# EAGLE design board 3 (EAGLE 9.6.2)
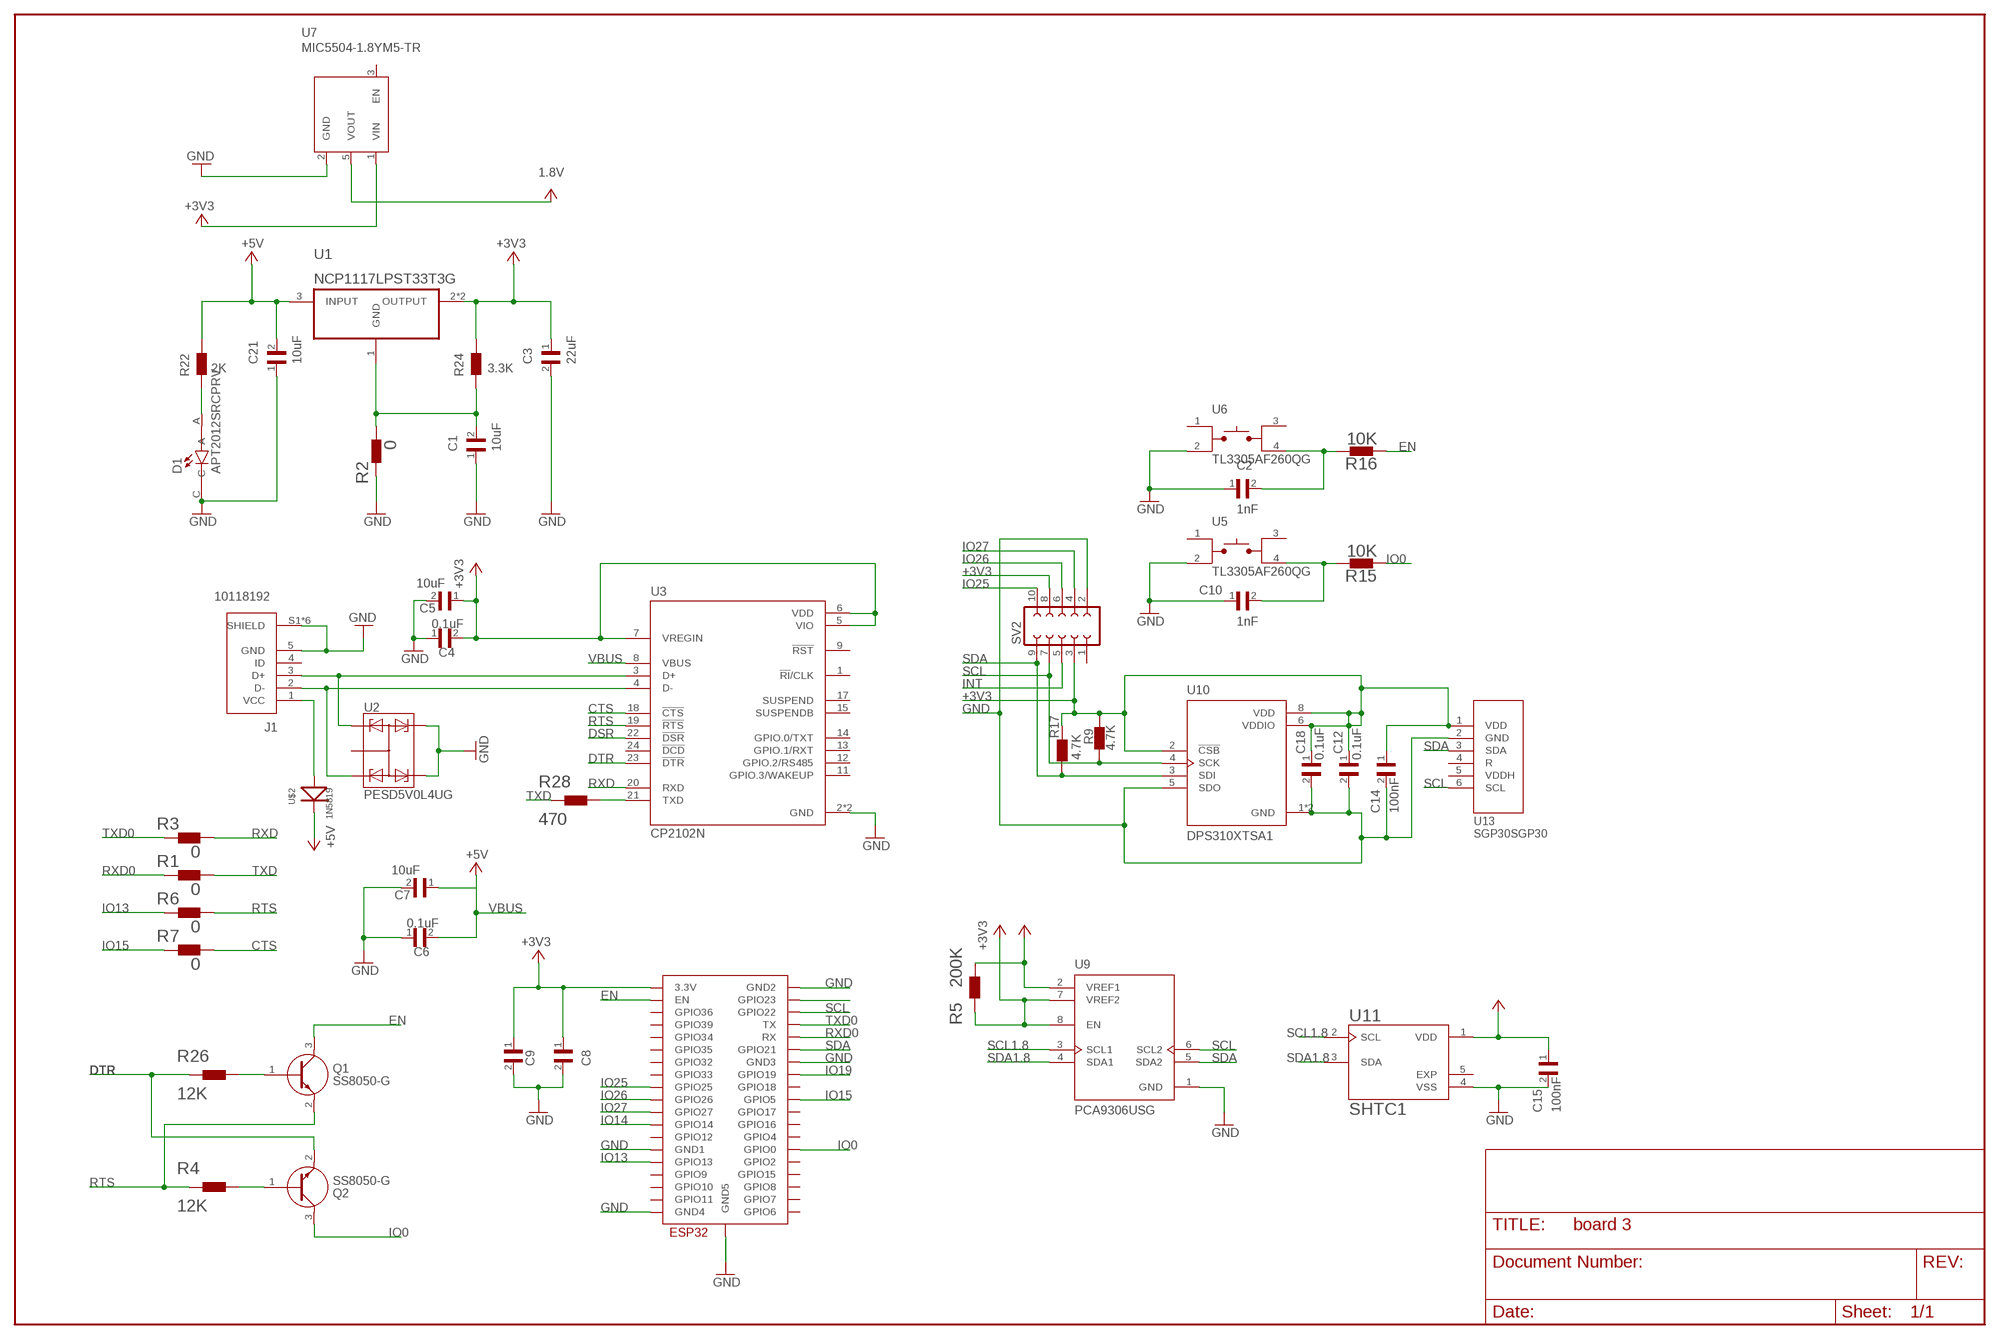
[diagram p0: schematic, sheet 1]

## Parts
C1  10uF  CL21A106KAYNNNE  [CAPC2012X135N]
C2  1nF  CL10B102KB8NNNC  [CAPC1608X90N]
C3  22uF  CL10A226MQ8NRNC  [CAPC1608X90N]
C4  0.1uF  CL05A104KA5NNNC  [CAPC1005X55N]
C5  10uF  CL21A106KAYNNNE  [CAPC2012X135N]
C6  0.1uF  CL05A104KA5NNNC  [CAPC1005X55N]
C7  10uF  CL21A106KAYNNNE  [CAPC2012X135N]
C8  CL10A475KQ8NNNC  [CAPC1608X90N]
C9  100uF 6.3V 20%  CL10A475KQ8NNNC  [CAPC1608X90N]
C10  1nF  CL10B102KB8NNNC  [CAPC1608X90N]
C12  0.1uF  CL05A104KA5NNNC  [CAPC1005X55N]
C14  100nF  CL10A226MQ8NRNC  [CAPC1608X90N]
C15  100nF  CL10A226MQ8NRNC  [CAPC1608X90N]
C18  0.1uF  CL05A104KA5NNNC  [CAPC1005X55N]
C21  10uF  CL21A106KAYNNNE  [CAPC2012X135N]
D1  APT2012SRCPRV  [LEDC2012X75N]
J1  10118192  10118192-0002LF  [AMPHENOL_10118192-0002LF]
Q1  SS8050-G  [SOT95P240X115-3N]
Q2  SS8050-G  [SOT95P240X115-3N]
R1  0  ERJ-1GE0R00C  [RESC0603X26N]
R2  0  ERJ-1GE0R00C  [RESC0603X26N]
R3  0  ERJ-1GE0R00C  [RESC0603X26N]
R4  12K  ERJ-P6WF1202V  [RESC2012X75N]
R5  200K  ERJ-P6WF2202V  [RESC2012X75N]
R6  0  ERJ-1GE0R00C  [RESC0603X26N]
R7  0  ERJ-1GE0R00C  [RESC0603X26N]
R9  4.7K  ERA-3AEB472V  [RESC1608X55N]
R15  10K  ERJ-P06F1002V  [RESC2012X70N]
R16  10K  ERJ-P06F1002V  [RESC2012X70N]
R17  4.7K  ERA-3AEB472V  [RESC1608X55N]
R22  2K  ERJ-P06D2001V  [RESC2012X70N]
R24  3.3K  ERJ-P06F3301V  [RESC2012X70N]
R26  12K  ERJ-P6WF1202V  [RESC2012X75N]
R28  470  ERJ-P14J471U  [RESC3225X70N]
SV2  FE05-2  [FE05-2]
U1  NCP1117LPST33T3G  [SOT230P700X175-4N]
U2  PESD5V0L4UG  PESD5V0L4UG,115  [SOT65P210X110-5N]
U3  CP2102N  CP2102N-A02-GQFN24R  [QFN50P400X400X80-25N]
U5  TL3305AF260QG  [SW_TL3305AF260QG]
U6  TL3305AF260QG  [SW_TL3305AF260QG]
U7  MIC5504-1.8YM5-TR  [SOT23-5P95_280X145XL45X37N]
U9  PCA9306USG  [SOP50P310X90-8N]
U10  DPS310XTSA1  [XDCR_DPS310XTSA1]
U11  SHTC1  [XDCR_SHTC1]
U13  SGP30SGP30  [SGP30]
U$1  ESP32-WROOM  [ESP32-WROOM]
U$2  1N5819  [SOD-123]

## Nets
1.8V: U7.5(VOUT) ; supply symbol labelled VCC
+3V3: C3.1 C4.2 C5.1 C8.1 C9.1 C12.1 C14.1 C18.1 R5.1 R9.2 R17.2 R24.2 SV2.3 SV2.8 U1.2(OUTPUT) U1.4(OUTPUT) U3.5(VIO) U3.6(VDD) U3.7(VREGIN) U7.1(VIN) U9.7(VREF2) U9.8(EN) U10.2(!CSB) U10.6(VDDIO) U10.8(VDD) U13.1(VDD) U$1.3V3(3.3V)
+5V: C21.2 R22.2 U1.3(INPUT) U$2.K
CTS: R7.2 U3.18(!CTS)
DSR: U3.22(!DSR)
DTR: Q2.2(E) R26.1 U3.23(!DTR)
EN: Q1.3(C) R16.1 U$1.EN
GND: C1.1 C2.1 C3.2 C4.1 C5.2 C6.1 C7.2 C8.2 C9.2 C10.1 C12.2 C14.2 C15.2 C18.2 C21.1 D1.C J1.5(GND) J1.S1(SHIELD) J1.S2(SHIELD) J1.S3(SHIELD) J1.S4(SHIELD) J1.S5(SHIELD) J1.S6(SHIELD) R2.1 SV2.2 U2.4 U2.5 U3.2(GND) U3.25(GND) U5.2 U6.2 U7.2(GND) U9.1(GND) U10.1(GND) U10.5(SDO) U10.7(GND) U11.4(VSS) U13.2(GND) U$1.GND1 U$1.GND2 U$1.GND3 U$1.GND4 U$1.GND5
INT: SV2.5
IO0: Q2.3(C) R15.1 U$1.IO0(GPIO0)
IO13: R6.1 U$1.IO13(GPIO13)
IO14: U$1.IO14(GPIO14)
IO15: R7.1 U$1.IO5(GPIO5)
IO19: U$1.IO19(GPIO19)
IO25: SV2.10 U$1.IO25(GPIO25)
IO26: SV2.6 U$1.IO26(GPIO26)
IO27: SV2.4 U$1.IO27(GPIO27)
N$1: J1.2(D-) U2.3 U3.4(D-)
N$2: J1.3(D+) U2.1 U3.3(D+)
N$3: J1.1(VCC) U$2.A
N$4: R28.2 U3.21(TXD)
N$5: D1.A R22.1
N$6: C1.2 R2.2 R24.1 U1.1(GND)
N$8: U$1.IO23(GPIO23)
N$9: Q1.1(B) R26.2
N$11: Q2.1(B) R4.2
N$14: C2.2 R16.2 U6.4
N$19: C10.2 R15.2 U5.4
RTS: Q1.2(E) R4.1 R6.2 U3.19(!RTS)
RXD: R3.2 U3.20(RXD)
RXD0: R1.1 U$1.RX
SCL: R9.1 SV2.7 U9.6(SCL2) U10.4(SCK) U13.6(SCL) U$1.IO22(GPIO22)
SCL1.8: U9.3(SCL1) U11.2(SCL)
SDA: R17.1 SV2.9 U9.5(SDA2) U10.3(SDI) U13.3(SDA) U$1.IO21(GPIO21)
SDA1.8: U9.4(SDA1) U11.3(SDA)
TXD: R1.2 R28.1
TXD0: R3.1 U$1.TX
VBUS: C6.2 C7.1 U3.8(VBUS) ; supply symbol labelled +5V
VCC: C15.1 R5.2 U9.2(VREF1) U11.1(VDD) ; supply symbol labelled 1.8V
Unconnected: J1.4(ID) SV2.1 U2.2 U3.1(!RI!/CLK) U3.9(!RST) U3.11(GPIO.3/WAKEUP) U3.12(GPIO.2/RS485) U3.13(GPIO.1/RXT) U3.14(GPIO.0/TXT) U3.15(SUSPENDB) U3.17(SUSPEND) U3.24(!DCD) U5.1 U5.3 U6.1 U6.3 U7.3(EN) U11.5(EXP) U13.4(R) U13.5(VDDH) U$1.CLK(GPIO6) U$1.CMD(GPIO11) U$1.IO2(GPIO2) U$1.IO4(GPIO4) U$1.IO12(GPIO12) U$1.IO15(GPIO15) U$1.IO16(GPIO16) U$1.IO17(GPIO17) U$1.IO18(GPIO18) U$1.IO32(GPIO32) U$1.IO33(GPIO33) U$1.IO34(GPIO34) U$1.IO35(GPIO35) U$1.SD0(GPIO7) U$1.SD1(GPIO8) U$1.SD2(GPIO9) U$1.SD3(GPIO10) U$1.SENSOR_VN(GPIO39) U$1.SENSOR_VP(GPIO36)

## Library data of the parts
C1 C5 C7 C21 = CL21A106KAYNNNE:CL21A106KAYNNNE: Cap Ceramic 10uF 25V X5R 10% SMD 0805 85°C Embossed T/R; DESCRIPTION: 10µF ±10% 25V Ceramic Capacitor X5R 0805 (2012 Metric); DIGI-KEY_PART_NUMBER: 1276-2891-1-ND; MF: Samsung Electro-Mechanics; MP: CL21A106KAYNNNE; PACKAGE: 0805 Samsung; PURCHASE-URL: https://pricing.snapeda.com/search/part/CL21A106KAYNNNE/?ref=eda
C2 C10 = CL10B102KB8NNNC:CL10B102KB8NNNC: Capacitor: ceramic; MLCC; 1nF; 50V; X7R; ±10%; SMD; 0603; -55÷125°C; DESCRIPTION: 1000pF ±10% 50V Ceramic Capacitor X7R 0603 (1608 Metric); DIGI-KEY_PART_NUMBER: 1276-1018-1-ND; MF: Samsung; MP: CL10B102KB8NNNC; PACKAGE: 0603 Samsung; PURCHASE-URL: https://pricing.snapeda.com/search/part/CL10B102KB8NNNC/?ref=eda
C3 C14 C15 = CL10A226MQ8NRNC:CL10A226MQ8NRNC: Cap Ceramic 22uF 6.3V X5R 20% SMD 0603 85°C Cardboard T/R; DESCRIPTION: 22µF ±20% 6.3V Ceramic Capacitor X5R 0603 (1608 Metric); DIGI-KEY_PART_NUMBER: 1276-1193-1-ND; MF: Samsung Electro-Mechanics; MP: CL10A226MQ8NRNC; PACKAGE: 0603 Samsung; PURCHASE-URL: https://pricing.snapeda.com/search/part/CL10A226MQ8NRNC/?ref=eda
C4 C6 C12 C18 = CL05A104KA5NNNC:CL05A104KA5NNNC: Capacitor [Samsung] CL05A104KA5NNNC Capacitor; DESCRIPTION: 0.1µF ±10% 25V Ceramic Capacitor X5R 0402 (1005 Metric); DIGI-KEY_PART_NUMBER: 1276-1043-1-ND; MF: Samsung Electro-Mechanics; MP: CL05A104KA5NNNC; PACKAGE: 0402 Samsung; PURCHASE-URL: https://pricing.snapeda.com/search/part/CL05A104KA5NNNC/?ref=eda
C8 C9 = CL10A475KQ8NNNC:CL10A475KQ8NNNC: Cap Ceramic 4.7uF 6.3V X5R 10% Pad SMD 0603 85C T/R; DESCRIPTION: 4.7µF ±10% 6.3V Ceramic Capacitor X5R 0603 (1608 Metric); DIGI-KEY_PART_NUMBER: 1276-1045-1-ND; MF: Samsung Electro-Mechanics; MP: CL10A475KQ8NNNC; PACKAGE: 0603 Samsung; PURCHASE-URL: https://pricing.snapeda.com/search/part/CL10A475KQ8NNNC/?ref=eda
D1 = APT2012SRCPRV:APT2012SRCPRV: 2.0X1.2MM,RED SMD LED; DESCRIPTION: Red 640nm LED Indication - Discrete 1.85V 0805 (2012 Metric); DIGI-KEY_PART_NUMBER: 754-1132-1-ND; MF: Kingbright; MP: APT2012SRCPRV; PACKAGE: 0805 Kingbright; PURCHASE-URL: https://pricing.snapeda.com/search/part/APT2012SRCPRV/?ref=eda
J1 = micro usb 10118192-0002LF:10118192-0002LF: USB - micro B USB 2.0 Receptacle Connector 5 Position Surface Mount, Right Angle; DESCRIPTION: USB - micro B USB 2.0 Receptacle Connector 5 Position Surface Mount, Right Angle; DIGI-KEY_PART_NUMBER: 609-5379-1-ND; MF: Amphenol ICC (FCI); MP: 10118192-0002LF; PACKAGE: None; PURCHASE-URL: https://pricing.snapeda.com/search/part/10118192-0002LF/?ref=eda
Q1 Q2 = SS8050-G:SS8050-G: Bipolar Transistors - BJT NPN TRANSISTOR 1.5A 40V Source: Datasheet <http://www.comchiptech.com/admin/files/product/SS8050-G RevA181526.pdf> Check prices <https://pricing.snapeda.com/parts/SS8050-G/Comchip%20Technology/view-part?ref=eda>; AVAILABILITY: Good; DESCRIPTION: Bipolar (BJT) Transistor NPN 25V 1.5A 100MHz 300mW Surface Mount SOT-23; MF: Comchip Technology; MP: SS8050-G; PACKAGE: TO-236 Comchip; PRICE: None; PURCHASE-URL: https://pricing.snapeda.com/search/part/SS8050-G/?ref=eda
R1-R3 R6 R7 = ERJ-1GE0R00C:ERJ-1GE0R00C: Res Thick Film 0201 0 Ohm Molded SMD Pressed Carrier T/R; DESCRIPTION: 0 Ohms Jumper 0.05W, 1/20W Chip Resistor 0201 (0603 Metric) Thick Film; DIGI-KEY_PART_NUMBER: P0.0AGCT-ND; MF: Panasonic Electronic; MP: ERJ-1GE0R00C; PACKAGE: 0603 Rohm Semiconductor; PURCHASE-URL: https://pricing.snapeda.com/search/part/ERJ-1GE0R00C/?ref=eda
R4 R26 = ERJ-P6WF1202V:ERJ-P6WF1202V; DESCRIPTION: RES SMD 12K OHM 1% 1/2W 0805; DIGI-KEY_PART_NUMBER: P16898CT-ND; MF: Panasonic; MP: ERJ-P6WF1202V; PACKAGE: 2012 Panasonic Electronic Components; PURCHASE-URL: https://pricing.snapeda.com/search/part/ERJ-P6WF1202V/?ref=eda
R5 = ERJ-P6WF2202V:ERJ-P6WF2202V; DESCRIPTION: RES SMD 22K OHM 1% 1/2W 0805; DIGI-KEY_PART_NUMBER: P16901CT-ND; MF: Panasonic; MP: ERJ-P6WF2202V; PACKAGE: 2012 Panasonic Electronic Components; PURCHASE-URL: https://pricing.snapeda.com/search/part/ERJ-P6WF2202V/?ref=eda
R9 R17 = ERA-3AEB472V:ERA-3AEB472V: Resistor;Metal Film;Res 4.7 Kilohms;Pwr-Rtg 0.1 W;Tol 0.1%;SMT;0603;Tape & Reel; DESCRIPTION: 4.7 kOhms ±0.1% 0.1W, 1/10W Chip Resistor 0603 (1608 Metric) Automotive AEC-Q200 Thin Film; DIGI-KEY_PART_NUMBER: P4.7KDBCT-ND; MF: Panasonic; MP: ERA-3AEB472V; PACKAGE: 1608 Panasonic Electronic Components; PURCHASE-URL: https://pricing.snapeda.com/search/part/ERA-3AEB472V/?ref=eda
R15 R16 = ERJ-P06F1002V:ERJ-P06F1002V: Surface Mount Chip Resistor, Thick Film, AEC-Q200 ERJ Series, 10 kohm, 500 mW, 1%, 400 V; DESCRIPTION: 10 kOhms ±1% 0.5W, 1/2W Chip Resistor 0805 (2012 Metric) Automotive AEC-Q200, Pulse Withstanding Thick Film; DIGI-KEY_PART_NUMBER: P16059CT-ND; MF: Panasonic; MP: ERJ-P06F1002V; PACKAGE: 2012 Panasonic Electronic Components; PURCHASE-URL: https://pricing.snapeda.com/search/part/ERJ-P06F1002V/?ref=eda
R22 = ERJ-P06D2001V:ERJ-P06D2001V; DESCRIPTION: Res Thick Film 0805 2K Ohm 0.5% 0.5W(1/2W) ±100ppm/°C Pad SMD Automotive T/R; DIGI-KEY_PART_NUMBER: P16044CT-ND; MF: Panasonic Electronic; MP: ERJ-P06D2001V; PACKAGE: 2012 Panasonic Electronic Components; PURCHASE-URL: https://pricing.snapeda.com/search/part/ERJ-P06D2001V/?ref=eda
R24 = ERJ-P06F3301V:ERJ-P06F3301V: Anti-Surge Chip Resistor, 0805 3.3 K ohms, 1.0%, 0; DESCRIPTION: 3.3 kOhms ±1% 0.5W, 1/2W Chip Resistor 0805 (2012 Metric) Automotive AEC-Q200, Pulse Withstanding Thick Film; DIGI-KEY_PART_NUMBER: P16070CT-ND; MF: Panasonic; MP: ERJ-P06F3301V; PACKAGE: 2012 Panasonic Electronic Components
R28 = ERJ-P14J471U:ERJ-P14J471U; DESCRIPTION: 470 Ohms ±5% 0.5W, 1/2W Chip Resistor 1210 (3225 Metric) Automotive AEC-Q200, Pulse Withstanding Thick Film; DIGI-KEY_PART_NUMBER: P470ASCT-ND; MF: Panasonic Electronic Components; MP: ERJ-P14J471U; PACKAGE: 3225 Panasonic Electronic Components; PURCHASE-URL: https://pricing.snapeda.com/search/part/ERJ-P14J471U/?ref=eda
SV2 = con-lsta:FE05-2: FEMALE HEADER; OC_FARNELL: unknown; OC_NEWARK: unknown
U1 = NCP1117LPST33T3G:NCP1117LPST33T3G: None Check prices <https://pricing.snapeda.com/parts/NCP1117LPST33T3G/Rochester%20Electronics%2C%20LLC/view-part?ref=eda>; AVAILABILITY: Good; DESCRIPTION: Linear Voltage Regulator IC 1 Output 1A SOT-223; MF: Rochester Electronics, LLC; MP: NCP1117LPST33T3G; PACKAGE: None; PRICE: None; PURCHASE-URL: https://pricing.snapeda.com/search/part/NCP1117LPST33T3G/?ref=eda
U2 = PESD5V0L4UG_115:PESD5V0L4UG,115: PESDxL4UG Series 10 V 19 pF Low Capacitance ESD Protection Diode Array - SOT-353; DESCRIPTION: 13V Clamp 2.5A (8/20µs) Ipp Tvs Diode Surface Mount 5-TSSOP; DIGI-KEY_PART_NUMBER: 1727-3835-1-ND; MF: Nexperia USA; MP: PESD5V0L4UG,115; PACKAGE: TSSOP5-5 Nexperia; PURCHASE-URL: https://pricing.snapeda.com/search/part/PESD5V0L4UG,115/?ref=eda
U3 = CP2102N-A02-GQFN24R:CP2102N-A02-GQFN24R; DESCRIPTION: USB Bridge, USB to UART USB 2.0 UART Interface 24-QFN (4x4); DIGI-KEY_PART_NUMBER: 336-5888-1-ND; MF: Silicon Labs; MP: CP2102N-A02-GQFN24R; PACKAGE: WFQFN-24 Silicon Labs; PURCHASE-URL: https://pricing.snapeda.com/search/part/CP2102N-A02-GQFN24R/?ref=eda
U5 U6 = TL3305AF260QG:TL3305AF260QG: Switch Tactile Spst-No 50ma 12v Check prices <https://pricing.snapeda.com/parts/TL3305AF260QG/E-Switch/view-part?ref=eda>; AVAILABILITY: Warning; DESCRIPTION: Tactile Switch SPST-NO Top Actuated Surface Mount; MF: E-Switch; MP: TL3305AF260QG; PACKAGE: SMD-4 E-Switch; PRICE: None; PURCHASE-URL: https://pricing.snapeda.com/search/part/TL3305AF260QG/?ref=eda
U7 = MIC5504-1.8YM5-TR:MIC5504-1.8YM5-TR: Single 300mA LDO with Enable Pull-Down & Auto Discharge, 5 SOT-23 T/R Check prices <https://pricing.snapeda.com/parts/MIC5504-1.8YM5-TR/Microchip%20Technology%20/%20Micrel/view-part?ref=eda>; AVAILABILITY: Good; DESCRIPTION: LDO Voltage Regulators Single 300mA LDO with Enable Pull-Down & Auto Discharge; MF: Microchip Technology / Micrel; MP: MIC5504-1.8YM5-TR; PACKAGE: None; PRICE: None; PURCHASE-URL: https://pricing.snapeda.com/search/part/MIC5504-1.8YM5-TR/?ref=eda
U9 = PCA9306USG:PCA9306USG: Voltage Level Translator Bidirectional 1 Circuit 2 Channel US8; DESCRIPTION: Voltage Level Translator Bidirectional 1 Circuit 2 Channel US8; DIGI-KEY_PART_NUMBER: PCA9306USGOSCT-ND; MF: ON Semiconductor; MP: PCA9306USG; PACKAGE: VFSOP-8 ON Semiconductor; PURCHASE-URL: https://pricing.snapeda.com/search/part/PCA9306USG/?ref=eda
U10 = DPS310XTSA1:DPS310XTSA1: Pressure Sensor 0.3kPa to 1.2kPa Absolute 8-Pin LGA; DESCRIPTION: Supply voltage range 1.7V to 3.6V | Operation range 300hPa 1200hPa | Sensors precision 0.005hPa | Relative accuracy 0.06hPa | Pressure temperature sensitivity of 0.5Pa/K | Temperature accuracy 0.5C; DIGI-KEY_PART_NUMBER: DPS310XTSA1CT-ND; MF: Infineon; MP: DPS310XTSA1; PACKAGE: LGA-8 Infineon; PURCHASE-URL: https://pricing.snapeda.com/search/part/DPS310XTSA1/?ref=eda
U11 = SHTC1:SHTC1: SENSOR HUMI/TEMP 1.8V I2C 3% SMD; DESCRIPTION: SENSOR HUMI/TEMP 1.8V I2C 3% SMD; DIGI-KEY_PART_NUMBER: 1649-1015-1-ND; MF: Sensirion AG; MP: SHTC1; PACKAGE: DFN-4 Sensirion; PURCHASE-URL: https://pricing.snapeda.com/search/part/SHTC1/?ref=eda
U13 = SGP30:SGP30: Check prices <https://pricing.snapeda.com/parts/SGP30/Sensirion%20AG/view-part?ref=eda>; AVAILABILITY: In Stock; DESCRIPTION: AIR QUALITY GAS SENSOR FOR VOC'S; MF: Sensirion AG; MP: SGP30; PACKAGE: None; PRICE: None; PURCHASE-URL: https://pricing.snapeda.com/search/part/SGP30/?ref=eda
U$1 = ESP32:ESP32-WROOM
U$2 = 1N5819:1N5819; DESCRIPTION: Diode Schottky 40V 1A Through Hole DO-41; DIGI-KEY_PART_NUMBER: 497-6610-1-ND; MF: STMicroelectronics; MP: 1N5819; PACKAGE: DO-41 STMicroelectronics; PURCHASE-URL: https://pricing.snapeda.com/search/part/1N5819/?ref=eda

## Board
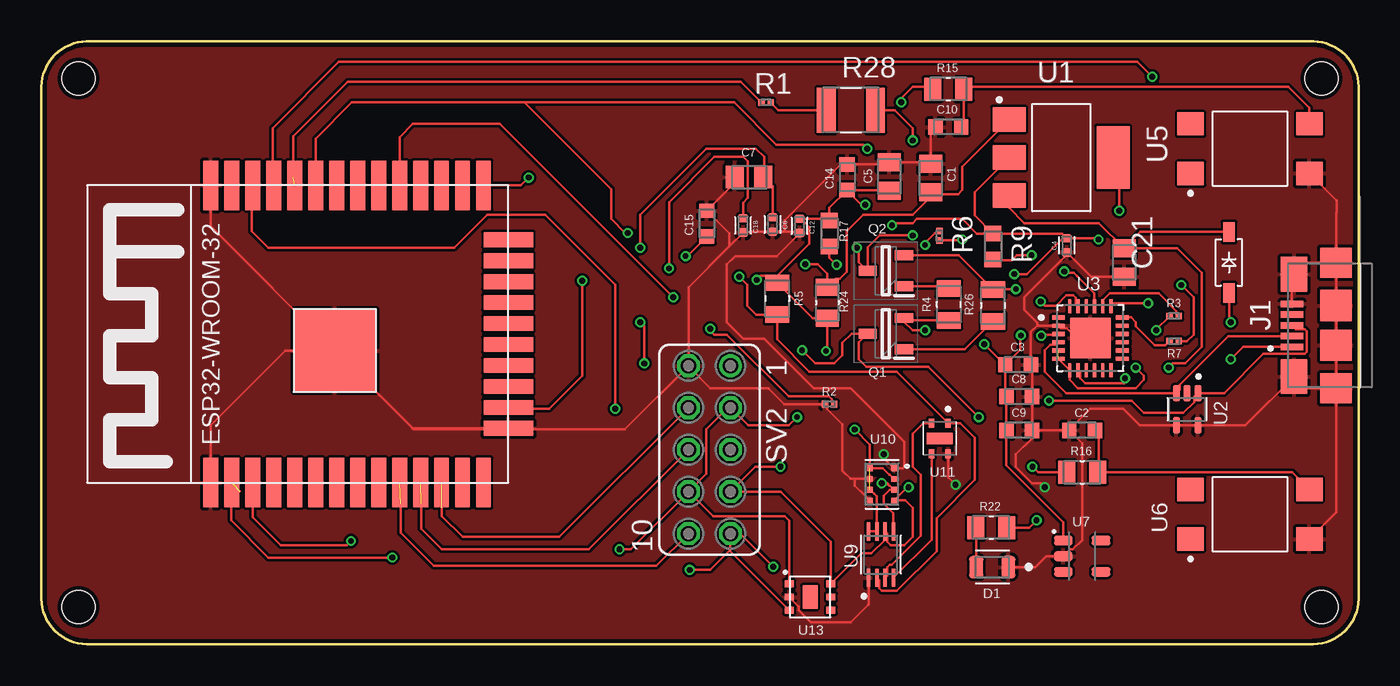
[diagram p1: board, top side]
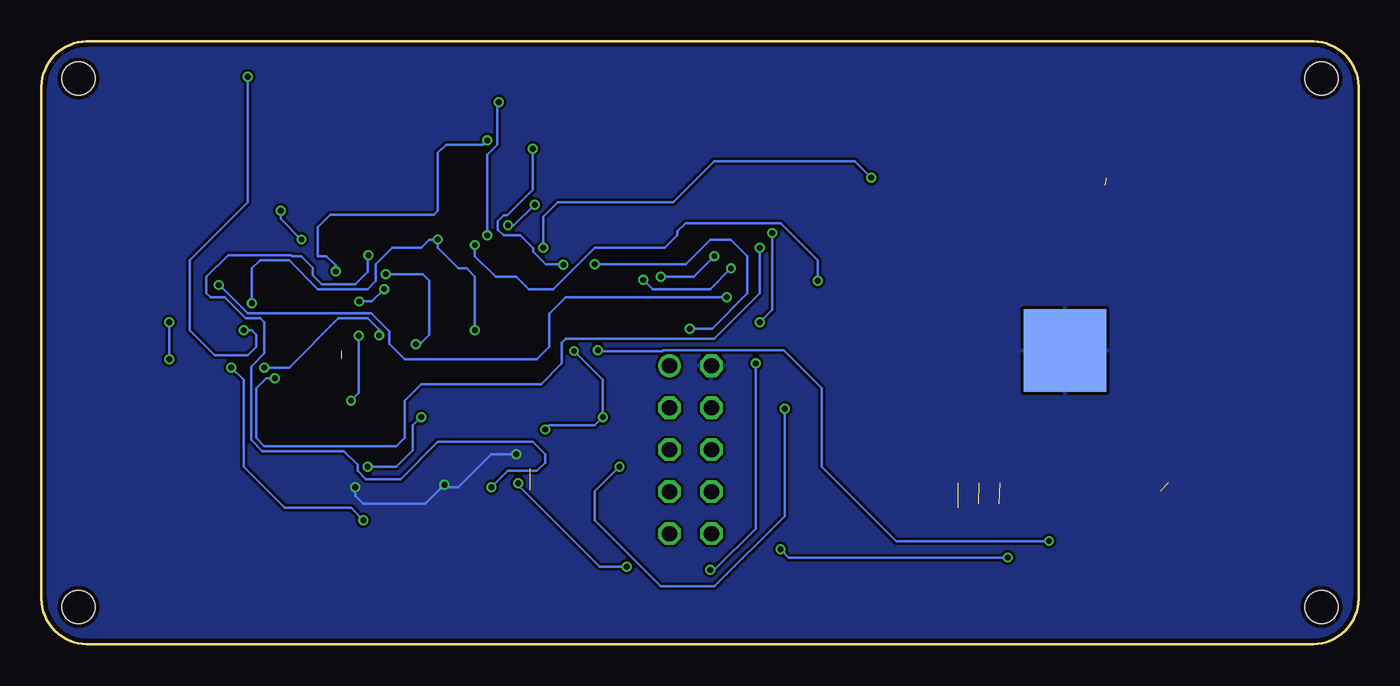
[diagram p2: board, bottom side, seen from below]

Size 79.75 x 36.5 mm. Coordinates in mm from the lower left corner, seen from the top.
Outline: 2.75,36.5 77,36.5 arc-87 79.75,33.75 79.75,2.75 arc-87 77,0 2.75,0 arc-87 0,2.75 0,33.75 arc-87 2.75,36.5
Copper layers (1*16): Top 0.018mm / dielectric 1.55mm / Bottom 0.018mm
Design rules "eC_2Layer_PClass6_BaseCopperO18_eCDefault": minimum track width 0.15mm, minimum drill 0.35mm, track to track 0.15mm, track to pad 0.15mm, pad to pad 0.15mm, via to via 0.15mm, smd to smd 0mil, copper to edge 0.25mm, drill to drill 0.35mm, minimum pad ring 0.175mm, minimum via ring 0.125mm, stop-mask expansion 0mil, vias tented up to drill 0.45mm, thermal gap 0.2mm
Holes 2 mm at 2.25,34.25 2.25,2.25 77.5,2.25 77.5,34.25

### Footprints (pad centres in the part's own frame; a part is rotated, then mirrored left to right if it is on the bottom)
CAPC2012X135N = smd 1.1 x 1.38: 1 -0.863,0; 2 0.863,0
CAPC1608X90N = smd 0.87 x 0.93: 1 -0.78,0; 2 0.78,0
CAPC1005X55N = smd 0.54 x 0.6: 1 -0.43,0; 2 0.43,0
LEDC2012X75N = smd 0.86 x 1.36: A 0.975,0; C -0.975,0
AMPHENOL_10118192-0002LF = smd 0.4 x 1.35: 1 -1.3,0; 2 -0.65,0; 3 0,0; 4 0.65,0; 5 1.3,0 | smd 2.1 x 1.6: S1 -3.1,-0.125; S2 3.1,-0.125 | smd 1.8 x 1.9: S3 -3.8,-2.675; S6 3.8,-2.675 | smd 1.9 x 1.9: S4 -1.2,-2.675; S5 1.2,-2.675
SOT95P240X115-3N = smd 1.1 x 0.6: 1 -1.1,0.95; 2 -1.1,-0.95; 3 1.1,0
RESC0603X26N = smd 0.38 x 0.4: 1 -0.281,0; 2 0.281,0
RESC2012X75N = smd 0.99 x 1.47: 1 -0.965,0; 2 0.965,0
RESC1608X55N = smd 0.94 x 1.02: 1 -0.79,0; 2 0.79,0
RESC2012X70N = smd 1.04 x 1.38: 1 -0.94,0; 2 0.94,0
RESC3225X70N = smd 1.14 x 2.72: 1 -1.49,0; 2 1.49,0
FE05-2 = drill 0.914: 1 -5.08,1.27 | drill 0.914 octagon: 2 -5.08,-1.27; 3 -2.54,1.27; 4 -2.54,-1.27; 5 0,1.27; 6 0,-1.27; 7 2.54,1.27; 8 2.54,-1.27; 9 5.08,1.27; 10 5.08,-1.27
SOT230P700X175-4N = smd 2 x 1.5: 1 -3.15,2.3; 2 -3.15,0; 3 -3.15,-2.3 | smd 2 x 3.8: 4 3.15,0
SOT65P210X110-5N = smd 0.99 x 0.41: 1 -0.97,0.65; 2 -0.97,0; 3 -0.97,-0.65; 4 0.97,-0.65; 5 0.97,0.65
QFN50P400X400X80-25N = smd 0.84 x 0.26: 1 -1.935,1.25; 2 -1.935,0.75; 3 -1.935,0.25; 4 -1.935,-0.25; 5 -1.935,-0.75; 6 -1.935,-1.25; 13 1.935,-1.25; 14 1.935,-0.75; 15 1.935,-0.25; 16 1.935,0.25; 17 1.935,0.75; 18 1.935,1.25 | smd 0.26 x 0.84: 7 -1.25,-1.935; 8 -0.75,-1.935; 9 -0.25,-1.935; 10 0.25,-1.935; 11 0.75,-1.935; 12 1.25,-1.935; 19 1.25,1.935; 20 0.75,1.935; 21 0.25,1.935; 22 -0.25,1.935; 23 -0.75,1.935; 24 -1.25,1.935 | smd 2.45 x 2.45: 25 0,0
SW_TL3305AF260QG = smd 1.4 x 1.6: 1 -1.5,3.6; 2 -1.5,-3.6; 3 1.5,3.6; 4 1.5,-3.6
SOT23-5P95_280X145XL45X37N = smd 1.14 x 0.6: 1 -1.14,0.95; 2 -1.14,0; 3 -1.14,-0.95; 4 1.14,-0.95; 5 1.14,0.95
SOP50P310X90-8N = smd 1.12 x 0.27: 1 -1.405,0.75; 2 -1.405,0.25; 3 -1.405,-0.25; 4 -1.405,-0.75; 5 1.405,-0.75; 6 1.405,-0.25; 7 1.405,0.25; 8 1.405,0.75
XDCR_DPS310XTSA1 = smd 0.35 x 0.35: 1 0.725,0.975; 2 0.725,0.325; 3 0.725,-0.325; 4 0.725,-0.975; 5 -0.725,-0.975; 6 -0.725,-0.325; 7 -0.725,0.325; 8 -0.725,0.975
XDCR_SHTC1 = smd 0.55 x 0.35: 1 -0.925,0.5; 2 -0.925,-0.5; 3 0.925,-0.5; 4 0.925,0.5 | smd 0.7 x 1.6: 5 0,0
SGP30 = smd 0.55 x 0.4: 1 -1.26,0.8; 2 -1.26,0; 3 -1.26,-0.8; 4 1.26,-0.8; 5 1.26,0; 6 1.26,0.8 | smd 0.9 x 1.4: P$7 0,0
ESP32-WROOM = smd 3 x 0.9: 3V3 0,16.74; EN 0,15.47; GND1 0,18.01; GND3 18,18.01; IO0 18,1.5; IO4 18,2.77; IO5 18,6.58; IO12 0,1.5; IO14 0,2.77; IO16 18,4.04; IO17 18,5.31; IO18 18,7.85; IO19 18,9.12; IO21 18,11.66; IO22 18,15.47; IO23 18,16.74; IO25 0,6.58; IO26 0,5.31; IO27 0,4.04; IO32 0,9.12; IO33 0,7.85; IO34 0,11.66; IO35 0,10.39; NC 18,10.39; RX 18,12.93; SENSOR_VN 0,12.93; SENSOR_VP 0,14.2; TX 18,14.2 | smd 0.9 x 3: CLK 9.635,0; CMD 8.365,0; GND2 3.285,0; IO2 14.715,0; IO13 4.555,0; IO15 13.445,0; SD0 10.905,0; SD1 12.175,0; SD2 5.825,0; SD3 7.095,0 | smd 5 x 5: GND4 8,10.5 | smd 5 x 5 bottom: GND5 8,10.5
SOD-123 = smd 1.2 x 0.7: A -1.85,0; K 1.85,0

### Placement (x,y rotation side)
C1  53.85,28.23 270 top
C2  63.01,12.95 0 top
C3  59.13,16.92 0 top
C4  62.08,24.15 90 top
C5  51.33,28.31 90 top
C6  44.27,25.41 90 top
C7  42.85,28.28 180 top
C8  59.2,14.99 0 top
C9  59.2,12.95 0 top
C10  54.91,31.31 0 top
C12  45.9,25.32 270 top
C14  48.78,28.27 90 top
C15  40.28,25.46 90 top
C18  42.48,25.35 270 top
C21  65.55,23.11 90 top
D1  57.57,4.67 180 top
J1  75.71,19.3 90 top
Q1  51.12,18.8 180 top
Q2  51.12,22.61 180 top
R1  43.88,32.79 0 top
R2  47.72,14.53 0 top
R3  68.58,19.87 0 top
R4  54.93,20.57 90 top
R5  44.55,20.92 270 top
R6  54.37,24.73 270 top
R7  68.58,18.35 180 top
R9  57.6,24.07 90 top
R15  54.91,33.6 0 top
R16  63.01,10.41 0 top
R17  47.7,24.87 90 top
R22  57.5,7.06 0 top
R24  47.58,20.68 270 top
R26  57.61,20.51 270 top
R28  49.01,32.33 0 top
SV2  40.45,11.78 270 top
U1  61.74,29.46 0 top
U2  69.36,14.22 270 top
U3  63.51,18.53 0 top
U5  73.17,30 90 top
U6  73.17,7.87 90 top
U7  63.01,5.33 0 top
U9  50.83,5.43 90 top
U10  50.89,9.68 0 top
U11  54.39,12.46 270 top
U13  46.54,2.86 0 top
U$1  28.27,9.78 90 top
U$2  71.9,23.11 90 top

### Tracks (layer width: path | path; a pad name or v marks a point on that pad's centre or on a via)
+3V3  (via drill 0.35)  (3 unrouted)
  Top 0.152: U7.1 61.87,7.38 58.42,10.83 C9.1 C8.1 58.35,15.06 C3.1 | R9.2 61.8,24.86 C4.2 | U1.2 56.5,27.37 56.5,25.96 R9.2 | C12.1 46,25.75 | 46,25.75 47.61,25.75 R17.2 47.7,26.41 C14.1 | C14.1 51.29,27.49 C5.1 | U9.8 U9.7 50.58,8.96 50.44,9.11 50.41,9.11 U10.6 | 44.55,22.3 R5.1 46.69,19.74 R24.2 47.58,17.83 v47.5,17.75 | 44.55,22.3 46.5,24.25 46.5,25.25 46,25.75 | SV2.8 40.67,7.75 45,7.75 45.28,7.47 U13.1 | SV2.8 40.25,10.31 40.25,13 41.57,14.32 SV2.3 42.79,13.25 45.25,13.25 v45.75,13.75 | U1.4 65.25,29.1 v65.25,26.25 | v64,24.5 63.92,24.58 C4.2 | SV2.8 35.69,5.75 v35,5.75 | v21.25,5.25 13.75,5.25 11.5,7.5 11.5,8.75 12,9.25 | U10.2 51.37,10.25 51.34,10.25 50.94,10.65 U10.8 50.16,12.09 v49.25,13 | U3.6 U3.7 62.25,16.59 62.25,16 62.75,15.5 66.25,15.5 66.75,16 66.75,16.25 v66.25,16.75 | C3.1 59.25,17.82 59.25,18.75 v59.3,18.7 | R9.2 56.64,24.86 55.75,25.75 53,25.75 52.75,25.5 51.64,25.5 v51.5,25.36 | v49.88,26.61 49.64,26.61 48.78,27.47 C14.1 | R9.2 59.39,24.86 | v58.89,22.41 59.66,22.41 61.83,24.58 C4.2 | v57.09,18.16 58.33,16.92 C3.1 | C18.1 42.48,26.73 42.77,27.02 42.77,29.23 42.5,29.5 40.75,29.5 38,26.75 v38,22.75 | v43.3,22.05 43.55,22.3 44.55,22.3
  Bottom 0.152: v65.25,26.25 65.25,25.75 v64,24.5 | v35,5.75 34.5,5.25 v21.25,5.25 | v47.5,17.75 45.75,16 v45.75,13.75 46.25,13.25 49,13.25 v49.25,13 | v59.3,18.7 59.3,19.04 60,19.73 61.77,19.73 64.75,16.75 v66.25,16.75 | v51.5,25.36 51.14,25.36 49.89,26.61 v49.88,26.61 | v58.89,22.41 56.66,22.41 56.25,22 56.25,18.75 56.75,18.25 57,18.25 v57.09,18.16 | v38,22.75 39.25,21.5 42.75,21.5 v43.3,22.05
+5V  (via drill 0.35)
  Top 0.152: U$2.K 66.54,24.96 C21.2 | C21.2 64.02,25.5 59.5,25.5 58.59,26.41 U1.3 | R22.2 59.81,7.06 v60.25,7.5 | v68.25,16.75 68.5,17 69.25,17 70.25,18 70.25,22.5 68.78,23.97 C21.2
  Bottom 0.152: v60.25,7.5 61,8.25 65,8.25 67.5,10.75 67.5,16 v68.25,16.75
CTS
  Top 0.152: R7.2 68.05,18.1 67.4,18.1 66.25,19.25 66.25,19.5 65.97,19.78 U3.18
DTR  (via drill 0.35)
  Top 0.152: Q2.2 55.53,23.56 R26.1 57.63,21.5 v59,21.5 | U3.23 62.62,20.61 62.62,20.96 62.47,21.11 62.05,21.11 61.44,20.5 60.75,20.5 v60.5,20.75
  Bottom 0.152: v60.5,20.75 59.75,20.75 v59,21.5
EN  (via drill 0.35)
  Top 0.152: R16.1 60.34,10.41 v60,10.75 | v56.75,13.75 53.69,16.8 49.94,16.8 49.5,17.25 49.5,18.28 Q1.3 49.05,18.8 48.5,18.25 48.5,17.5 48,17 46.86,17 v46.05,17.8 | U$1.EN 12.8,7.7 14.5,6 18.5,6 v18.75,6.25
  Bottom 0.152: v60,10.75 58.25,10.75 57.25,11.75 57.25,13.25 v56.75,13.75 | v18.75,6.25 28,6.25 32.5,10.75 32.5,15.5 34.8,17.8 42.11,17.8 42.16,17.75 46,17.75 v46.05,17.8
GND  (via drill 0.35)
  Top 0.152: J1.5 75.71,22.27 J1.S2 76.53,23.1 J1.S6 | J1.S6 J1.S5 J1.S4 J1.S3 | J1.S3 76.53,15.5 J1.S1 72.88,13.25 U2.5 U2.4 66.5,13.25 65.5,14.25 63.5,14.25 62.23,12.98 C2.1 | U6.2 78.38,7.99 J1.S3 | D1.C 60.17,4.67 60.83,5.33 U7.2 62.29,5.75 62.44,5.75 63,6.31 63,12.18 C2.1 | C21.1 63.55,22.25 C4.1 62.08,23.58 59.5,21 59.5,20.25 60.28,19.47 60.28,19.28 | 60.97,19.28 U3.2 | 41.66,24.09 C18.2 42.54,24.98 C6.1 45,24.98 | 41.66,24.09 39.18,21.62 SV2.2 | 45,24.98 45.81,24.98 C12.2 44.51,23.5 42,23.5 41.5,23 41.5,19.5 42.5,18.5 43.75,18.5 46.75,15.5 49,15.5 52.25,12.25 52.25,10.75 52.16,10.65 U10.1 51,11.27 v51,11.5 | 41.66,24.09 41.66,24.86 C15.2 41.99,27.95 C7.2 | 45,24.98 45,25.66 48.39,29.05 C14.2 51.21,29.05 C5.2 53.77,29.17 C1.1 53.85,31.03 C10.1 | U13.2 45.86,2.28 45.86,2.06 46.58,1.34 49,1.34 50.08,2.42 U9.1 | C2.1 C9.2 | C9.2 C8.2 59.98,16.85 C3.2 59.91,18.91 60.28,19.28 | 49.25,10.01 49,10.01 48.5,10.5 48.5,13.32 47.58,14.23 47.58,14.39 R2.1 44.97,14.53 44,15.5 40.5,15.5 39.18,16.82 SV2.2 | 49.25,10.01 U10.7 | SV2.2 35.32,13 22.55,13 U$1.GND4 | U$1.GND4 17.75,17.78 | 17.75,17.78 14.78,17.78 10.25,13.25 U$1.GND1 | U$1.GND4 10.26,25.29 U$1.GND3 | J1.S6 78.38,26.14 78.41,26.16 78.41,26.86 U5.2 | U3.2 60.28,19.28 | C9.2 59.98,12.48 59,11.5 59,10.75 60,9.75 60.5,9.75 v60.75,9.5 | v55.35,9.65 54.89,10.11 U11.4 | U$1.GND2 22.47,13.06 17.75,17.78 | U3.2 61.72,19.14 62.07,19.14 62.68,18.53 U3.25 | U10.5 49.92,8.95 49.9,8.95 49.25,9.6 49.25,10.01
  Bottom 0.152: v60.75,9.5 60.75,9 60.25,8.5 56.5,8.5 55.38,9.62 | 55.38,9.62 v55.35,9.65 | v51,11.5 52.5,11.5 54.5,9.5 55.25,9.5 55.38,9.62
  pour Top: -0.25,36.75 -0.25,-0.25 83.25,-0.25 83.25,37 74.5,37 -0.25,37
  pour Bottom: -0.25,37.25 -0.25,-1.25 80.75,-1.25 80.75,37.25
IO0  (via drill 0.35)
  Top 0.152: v52.75,24.75 50.75,24.75 50.02,24.02 Q2.3 49.5,23.13 49.5,23.86 v49.36,24 | v52.05,32.8 52.05,33.05 52.75,33.75 53.82,33.75 R15.1 | v29.5,28.25 29.03,27.78 U$1.IO0
  Bottom 0.152: v52.75,24.75 52.75,29.64 52.14,30.25 52.14,32.61 52,32.75 v52.05,32.8 | v49.36,24 49.36,25.89 48.5,26.75 41.5,26.75 39,29.25 30.5,29.25 v29.5,28.25
IO13  (via drill 0.35)
  Top 0.152: R6.1 54.23,24.87 54.07,24.87 53.5,24.29 v53.5,24.17 53.5,24 | v32.75,22 32.75,16.25 30.75,14.25 28.36,14.25 U$1.IO13
  Bottom 0.152: v53.5,24.17 53.5,23.5 52.25,22.25 51,22.25 50.25,21.5 48.75,21.5 46.25,24 42,24 41.25,24.75 41.25,25 40.75,25.5 35,25.5 32.75,23.25 v32.75,22
IO15  (via drill 0.35)
  Top 0.152: R7.1 69.35,18.35 69.75,18.75 69.75,21 v69,21.75 | v38.25,21 27.75,31.5 22.5,31.5 21.69,30.69 U$1.IO5
  Bottom 0.152: v69,21.75 68.97,21.75 67.25,20.04 59.79,20.04 58.7,18.95 58.7,18.2 57.75,17.25 49.75,17.25 49,18 49,20 48,21 v38.25,21
IO25  (1 unrouted)
  Top 0.152: SV2.10 37.23,4.75 23.75,4.75 21.75,6.75 21.75,8.5
IO26  (1 unrouted)
  Top 0.152: SV2.6 33.15,5.75 24.25,5.75 23,7 23,8.5
IO27  (1 unrouted)
  Top 0.152: SV2.4 31.36,6.5 25.5,6.5 24.25,7.75 24.25,8.25
N$1
  Top 0.152: J1.2 71.86,18.65 68.93,15.72 68.93,15.41 U2.3 62.06,15.19 60.75,16.5 60.75,17.81 61.08,18.14 61.43,18.14 U3.4
N$2  (via drill 0.35)
  Top 0.152: J1.3 75.93,19.08 76.48,19.08 76.61,18.95 76.61,17.7 76.48,17.57 73.98,17.57 71.6,15.19 U2.1 69.79,14.97 69.79,14.66 69.13,14 66.75,14 66,14.75 v61,14.75 | U3.3 61.54,18.75 60.5,18.75 60.5,18.7 v60.53,18.67
  Bottom 0.152: v61,14.75 60.53,15.22 v60.53,18.67
N$3  (via drill 0.35)
  Top 0.152: U$2.A 71.9,19.6 v72,19.5 | v72,17.25 72.75,18 J1.1
  Bottom 0.152: v72,19.5 v72,17.25
N$4  (via drill 0.35)
  Top 0.152: U3.21 63.75,20.48 63.75,21.25 62.75,22.25 62.68,22.32 62.5,22.5 62,22.5 v61.93,22.57 | v52.75,30.5 52.75,31.25 51.67,32.33 R28.2
  Bottom 0.152: v52.75,30.5 53,30.25 55.25,30.25 55.75,29.75 55.75,26.25 56,26 62.25,26 63,25.25 63,23.5 62.5,23.5 61.93,22.93 v61.93,22.57
N$5
  Top 0.152: D1.A 56.59,7.03 R22.1
N$6  (via drill 0.35)
  Top 0.152: U1.1 55.75,28.92 55.75,27.5 55.5,27.25 53.97,27.25 | 53.97,27.25 C1.2 | 53.97,27.25 53.97,27.22 52.75,26 49.75,26 48.75,25 48.75,22.54 48.33,22.12 48.08,22.12 R24.1 47.58,22.42 47,23 v46.25,23 | R2.2 47.86,14.67 47.86,14.82 47.68,15 45.25,15 41.5,18.75 40.75,18.75 40.5,19 v40.5,19.11
  Bottom 0.152: v40.5,19.11 39.14,19.11 37,21.25 37,23.5 38,24.5 39.25,24.5 40.75,23 v46.25,23
N$9
  Top 0.152: Q1.1 55.91,17.85 R26.2
N$11
  Top 0.152: Q2.1 54.81,21.66 R4.2
N$14
  Top 0.152: U6.4 75.73,10.41 64,10.41 | 64,10.41 R16.2 | C2.2 64,12.74 64,10.41
N$19
  Top 0.152: C10.2 55.85,31.47 R15.2 56,33.75 75.5,33.75 76.77,32.48 U5.4
RTS  (via drill 0.35)
  Top 0.152: R4.1 52.37,19.61 Q1.2 52.22,19.53 52.75,19 v53.5,19 | R6.2 55.7,24.45 v55.75,24.5 | v67,20.64 64.94,20.64 U3.19
  Bottom 0.152: v53.5,19 53.5,22.25 54,22.75 54.5,22.75 55.75,24 v55.75,24.5 56.25,24.5 56.75,24 58.5,24 59.5,23 59.5,22 60,21.5 63,21.5 64.75,23.25 66.5,23.25 67,22.75 v67,20.64
RXD
  Top 0.152: R3.2 68.72,20.01 68.72,20.16 67.63,21.25 64.69,21.25 64.26,20.82 U3.20
RXD0  (1 unrouted)
  Top 0.152: R1.1 42.35,34.04 18.54,34.04 15.25,30.75 15.25,28.25
SCL  (via drill 0.35)
  Top 0.152: v44.75,10.75 43.23,10.75 SV2.7 44.76,9.24 47.8,6.2 U13.6 49.64,5.5 50.25,5.5 51.08,6.33 U9.6 51.22,6.7 51.22,6.2 51.42,6 52.25,6 52.75,6.5 52.75,8.25 52.29,8.71 U10.4 51.86,8.95 51.88,8.95 52.43,9.5 v52.5,9.5 | v34.75,14.25 34.75,21.75 30.5,26 27,26 25,24 13.75,24 12.75,25 12.75,27.73 U$1.IO22 | v59.95,23.55 59.05,23.55 58.75,23.25 57.63,23.25 R9.1
  Bottom 0.152: v44.75,10.75 46.25,9.25 46.25,7.5 42.25,3.5 39,3.5 34.75,7.75 v34.75,14.25 | v52.5,9.5 51.5,10.5 49.75,10.5 49.25,11 49.25,11.5 50,12.25 55.75,12.25 58,10 60.11,10 60.61,10.5 60.61,10.86 61.44,11.7 66.38,11.7 67.06,12.37 67.06,16.8 66.25,17.61 66.25,19.5 66.48,19.73 67.38,19.73 68.65,21 69.5,21 69.75,21.25 69.75,22.25 68.44,23.55 64.62,23.55 64.57,23.5 64,23.5 63.31,22.8 63.31,22.34 62.77,21.8 60.75,21.8 60,22.55 60,23.5 v59.95,23.55
SCL1.8
  Top 0.152: U9.3 51.22,4.16 51.22,4.66 51.37,4.81 51.5,4.81 53.25,6.57 53.25,10.25 52.75,10.75 52.75,12.75 53.38,13.38 U11.2
SDA  (via drill 0.35)
  Top 0.152: U13.3 41.72,5.62 SV2.9 | U9.5 51.58,7.92 51,8.5 51,9 51.35,9.36 U10.3 51.37,9.6 51.34,9.6 51.2,9.75 v50.87,9.75 | SV2.9 42.3,6.7 v44.3,4.7 | U$1.IO21 16.61,30.61 18.81,32.8 29.25,32.8 | 29.25,32.8 41.94,32.8 44.5,30.25 49.75,30.25 v50,30 | v48.14,22.96 47.7,23.41 R17.1 | 29.25,32.8 34.5,27.55 34.5,25.75 35.36,24.89 v35.5,24.89 | v36.25,19.5 36.5,19.25 v36.5,17 | v39.25,4.5 40.5,4.5 41.72,5.72 SV2.9
  Bottom 0.152: v44.3,4.7 45.95,4.7 50.75,9.5 50.75,9.75 v50.87,9.75 | v50,30 50,27.5 51.54,25.96 51.75,25.96 52.11,25.61 52.11,25.11 51.75,24.75 50.75,24.75 49.96,23.96 49.96,23.75 49.22,23 48.18,23 v48.14,22.96 | v35.5,24.89 35.5,20.25 v36.25,19.5 | v36.5,17 36.5,7 39,4.5 v39.25,4.5
SDA1.8
  Top 0.152: U9.4 53.89,6.33 U11.3
TXD
  Top 0.152: R28.1 44.62,32.33 R1.2
TXD0  (via drill 0.35)
  Top 0.152: v67.25,34.36 66.34,35.27 18.02,35.27 14,31.25 14,27.85 U$1.TX | v67.5,19 67.5,19.07 R3.1
  Bottom 0.152: v67.25,34.36 67.25,26.75 70.75,23.25 70.75,19 69.25,17.5 67.25,17.5 66.75,18 66.75,18.75 67,19 v67.5,19
VBUS  (via drill 0.35)
  Top 0.152: C7.1 43.75,28.25 | 43.75,28.25 44.27,27.72 C6.2 | U3.8 62.9,16.45 62.9,16.1 63.2,15.8 65.56,15.8 65.75,16 65.64,16.11 v65.61,16.11 | v36.25,24 36.25,26 40.25,30 43.25,30 43.75,29.5 43.75,28.25
  Bottom 0.152: v65.61,16.11 66.14,16.11 66.75,15.5 66.75,12.5 66.25,12 58.25,12 57.75,12.5 57.75,14.75 56.75,15.75 49.5,15.75 48.25,17 48.25,18.25 48,18.5 39,18.5 36.25,21.25 v36.25,24
VCC  (via drill 0.35)
  Top 0.152: U9.2 50.72,3.89 50.72,3.39 50.87,3.24 51.79,3.24 54.19,5.64 54.19,7.64 56.5,9.95 56.5,12.5 55.62,13.38 U11.1 51.78,16.5 46.5,16.5 44.55,18.45 R5.2 43.3,19.95 42.75,20.5 42.75,21.75 v42.25,22.25 | C15.1 39.1,23.5 v39,23.5
  Bottom 0.152: v39,23.5 40.25,22.25 v42.25,22.25